# Altium schematic sheet Bootloader.SchDoc
size A3
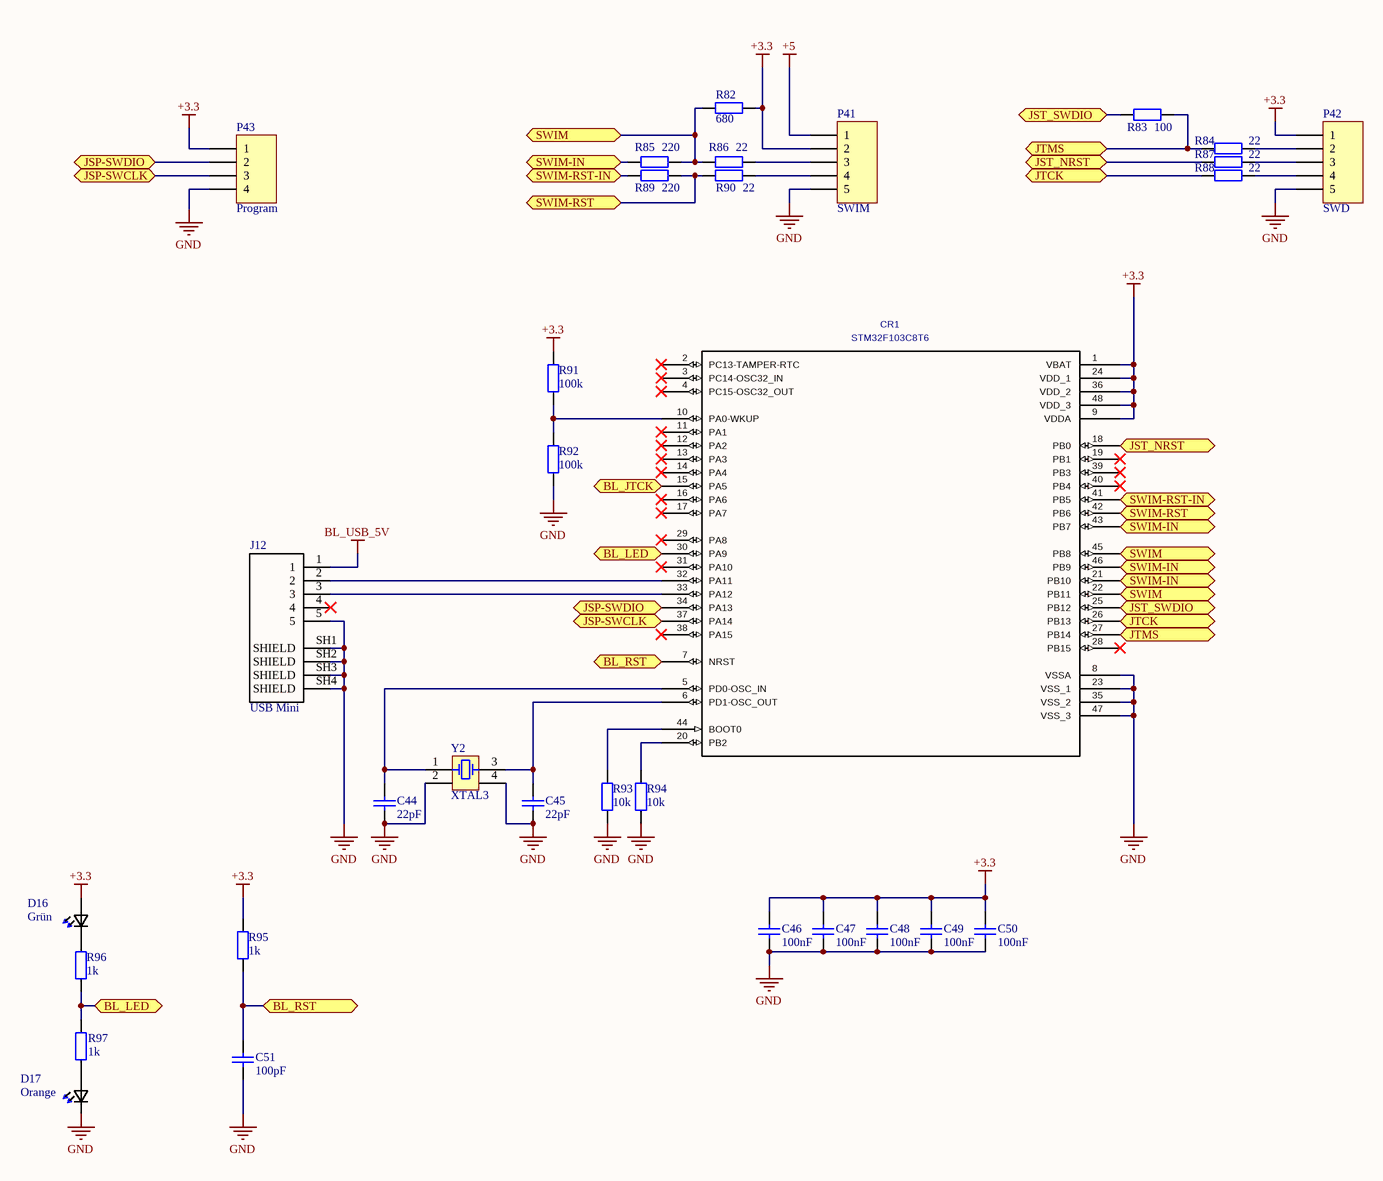
[diagram p0: Bootloader.SchDoc]

## Parts
C44  22pF  [CAP_0603i_1608m -N]
C45  22pF  [CAP_0603i_1608m -N]
C46  100nF  [CAP_0603i_1608m -N]
C47  100nF  [CAP_0603i_1608m -N]
C48  100nF  [CAP_0603i_1608m -N]
C49  100nF  [CAP_0603i_1608m -N]
C50  100nF  [CAP_0603i_1608m -N]
C51  100pF  [CAP_0603i_1608m -N]
CR1  STM32F103C8T6  [LQFP-48]
D16  Grün  [*0603]
D17  Orange  [*0603]
J12  USB Mini  [*CUI_UJ2-MABH-4-SMT_UJ2-MABH-4-SMT(Primary)]
P41  SWIM  [HDR1X5]
P42  SWD  [HDR1X5]
P43  Program  [HDR1X4]
R82  680  [RES_0603i_1608m -N]
R83  100  [RES_0603i_1608m -N]
R84  22  [RES_0603i_1608m -N]
R85  220  [RES_0603i_1608m -N]
R86  22  [RES_0603i_1608m -N]
R87  22  [RES_0603i_1608m -N]
R88  22  [RES_0603i_1608m -N]
R89  220  [RES_0603i_1608m -N]
R90  22  [RES_0603i_1608m -N]
R91  100k  [RES_0603i_1608m -N]
R92  100k  [RES_0603i_1608m -N]
R93  10k  [RES_0603i_1608m -N]
R94  10k  [RES_0603i_1608m -N]
R95  1k  [RES_0603i_1608m -N]
R96  1k  [RES_0603i_1608m -N]
R97  1k  [RES_0603i_1608m -N]
Y2  XTAL3  [TSX-3225 2*2.5]

## Ports
BL_JTCK (bidir), BL_LED (bidir), BL_RST (bidir), JSP-SWCLK (bidir), JSP-SWDIO (bidir), JST_NRST (bidir), JST_SWDIO (bidir), JTCK (bidir), JTMS (bidir), SWIM (bidir), SWIM-IN (bidir), SWIM-RST (bidir), SWIM-RST-IN (bidir)

## Nets
+3.3: C46.2 C47.2 C48.2 C49.2 C50.2 CR1.1(VBAT) CR1.9(VDDA) CR1.24(VDD_1) CR1.36(VDD_2) CR1.48(VDD_3) D16.2(A2) P41.2 P42.1 P43.1 R82.2 R91.2 R95.1
+5: P41.1
BL_USB_5V: J12.1
GND: C44.1 C45.1 C46.1 C47.1 C48.1 C49.1 C50.1 C51.1 CR1.8(VSSA) CR1.23(VSS_1) CR1.35(VSS_2) CR1.47(VSS_3) D17.1(K2) J12.5 J12.SH1(SHIELD) J12.SH2(SHIELD) J12.SH3(SHIELD) J12.SH4(SHIELD) P41.5 P42.5 P43.4 R92.1 R93.1 R94.1 Y2.2(COM) Y2.4(COM)
BL_JTCK: CR1.15(PA5) ; port BL_JTCK
BL_LED: CR1.30(PA9) R96.2 R97.2 ; port BL_LED
BL_RST: C51.2 CR1.7(NRST) R95.2 ; port BL_RST
JSP-SWCLK: CR1.37(PA14) P43.3 ; port JSP-SWCLK
JSP-SWDIO: CR1.34(PA13) P43.2 ; port JSP-SWDIO
JST_NRST: CR1.18(PB0) R87.2 ; port JST_NRST
JST_SWDIO: CR1.25(PB12) R83.2 ; port JST_SWDIO
JTCK: CR1.26(PB13) R88.2 ; port JTCK
JTMS: CR1.27(PB14) R83.1 R84.2 ; port JTMS
SWIM: CR1.22(PB11) CR1.45(PB8) R82.1 R85.1 R86.1 ; port SWIM
SWIM-IN: CR1.21(PB10) CR1.43(PB7) CR1.46(PB9) R85.2 ; port SWIM-IN
SWIM-RST: CR1.42(PB6) R89.1 R90.2 ; port SWIM-RST
SWIM-RST-IN: CR1.41(PB5) R89.2 ; port SWIM-RST-IN
NetC44_2: C44.2 CR1.5(PD0-OSC_IN) Y2.1(OSC1)
NetC45_2: C45.2 CR1.6(PD1-OSC_OUT) Y2.3(OSC2)
NetCR1_10: CR1.10(PA0-WKUP) R91.1 R92.2
NetCR1_20: CR1.20(PB2) R94.2
NetCR1_32: CR1.32(PA11) J12.2
NetCR1_33: CR1.33(PA12) J12.3
NetCR1_44: CR1.44(BOOT0) R93.2
NetD16_1: D16.1(K2) R96.1
NetD17_2: D17.2(A2) R97.1
NetP41_3: P41.3 R86.2
NetP41_4: P41.4 R90.1
NetP42_2: P42.2 R84.1
NetP42_3: P42.3 R87.1
NetP42_4: P42.4 R88.1

Not connected (* = marked no-connect by the designer): CR1 2(PC13-TAMPER-RTC)* 3(PC14-OSC32_IN)* 4(PC15-OSC32_OUT)* 11(PA1)* 12(PA2)* 13(PA3)* 14(PA4)* 16(PA6)* 17(PA7)* 19(PB1)* 28(PB15)* 29(PA8)* 31(PA10)* 38(PA15)* 39(PB3)* 40(PB4)*; J12 4*

## Notes on the sheet
- 1
- 2
- 3
- 4
- 5
- 6
- 7
- 8
- A
- B
- C
- D
- Project:
- Date:
- Drawing number:
- Rev:
- Format:
- A3
- Drawn by:
- Laboratory:
- Page
- Sheet:
- of
- File:

## Library data of the parts
C44-C51 = Cap: capacitor
CR1 = STM32F103C8T6: C: Copyright (C) 2015 Accelerated Designs. All rights reserved; Vendor: STMicroelectronics; Built_By: EMA_UL_Team; Value: STM32F103C8T6; Manufacturer_Part_Number: STM32F103C8T6
D16 = LTST-C191KGKT: / LED; SMD; 0603; grün; 35mcd; 1.6x0.8x0.55mm; 130Â°; 2Ã·2.V; 20mA /; MF: Lite-On Inc.; Digi-Key_Purchase_URL: https://www.digikey.ch/product-detail/de/lite-on-inc/LTST-C191KGKT/160-1446-1-ND/386834; SnapEDA_Link: https://www.snapeda.com/parts/LTST-C191KFKT/Lite-On%20Inc./view-part/?ref=snap; MP: LTST-C191KGKT; Digi-Key_Part_Number: 160-1446-1-ND; Package: 0603 Lite-On; Value: *
D17 = LTST-C191KFKT: / LED; SMD; 0603; orange; 45-90mcd; 1.6x0.8x0.55mm; 130Â°; 2Ã·2.4V; 20mA /; MF: Lite-On Inc.; Digi-Key_Purchase_URL: https://www.digikey.com/product-detail/en/lite-on-inc/LTST-C191KFKT/160-1445-1-ND/386832?utm_source=snapeda&utm_medium=aggregator&utm_campaign=symbol; SnapEDA_Link: https://www.snapeda.com/parts/LTST-C191KFKT/Lite-On%20Inc./view-part/?ref=snap; MP: LTST-C191KFKT; Digi-Key_Part_Number: 160-1445-1-ND; Package: 0603 Lite-On; Value: *
J12 = UJ2-MABH-4-SMT: Mini AB, USB 2.0, 1 A, Right Angle, Surface Mount _SMT_, USB Receptacle; MF: CUI Inc.; Digi-Key_Part_Number: 102-5890-1-ND; Package: None; Digi-Key_Purchase_URL: https://www.digikey.com/product-detail/en/cui-inc/UJ2-MABH-4-SMT-TR/102-5890-1-ND/9838992?utm_source=snapeda&utm_medium=aggregator&utm_campaign=symbol; CUI_purchase_URL: https://www.cui.com/product/interconnect/connectors/usb-connectors/uj2-mabh-smt-series?utm_source=snapeda.com&utm_medium=referral&utm_campaign=snapedaBOM; SnapEDA_Link: https://www.snapeda.com/parts/UJ2-MABH-4-SMT/CUI%20Inc./view-part/?ref=snap; MP: UJ2-MABH-4-SMT; Value: *
P41 P42 = Header 5: Header, 5-Pin
P43 = Header 4: Header, 4-Pin
R82-R97 = Res: Resistor
Y2 = XTAL3: Industrial Ceramic Resonator